# EAGLE design rectifiing (EAGLE 6.6.0)
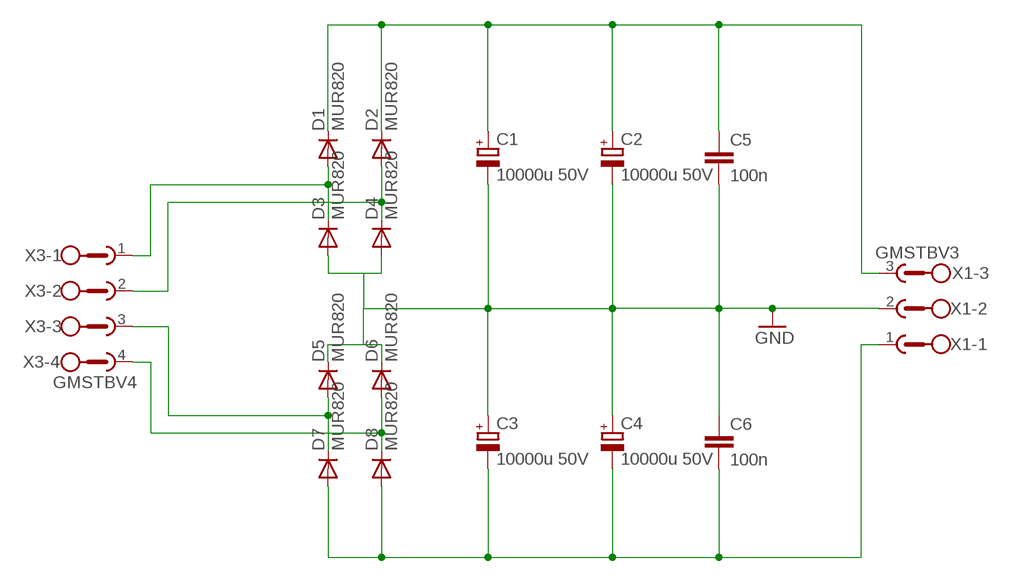
[diagram p0: schematic, sheet 1]

## Parts
C1  10000u 50V  CPOL-EUE10-30  [EB30D]
C2  10000u 50V  CPOL-EUE10-30  [EB30D]
C3  10000u 50V  CPOL-EUE10-30  [EB30D]
C4  10000u 50V  CPOL-EUE10-30  [EB30D]
C5  100n  C-EU075-032X103  [C075-032X103]
C6  100n  C-EU075-032X103  [C075-032X103]
D1  MUR820  MUR810  [TO220ACS]
D2  MUR820  MUR810  [TO220ACS]
D3  MUR820  MUR810  [TO220ACS]
D4  MUR820  MUR810  [TO220ACS]
D5  MUR820  MUR810  [TO220ACS]
D6  MUR820  MUR810  [TO220ACS]
D7  MUR820  MUR810  [TO220ACS]
D8  MUR820  MUR810  [TO220ACS]
X1  GMSTBV3  [GMSTBV3]
X3  GMSTBV4  [GMSTBV4]

## Nets
GND: C1.- C2.- C3.+ C4.+ C5.2 C6.1 D3.A D4.A D5.C D6.C X1.2
N$1: C1.+ C2.+ C5.1 D1.C D2.C X1.3
N$2: C3.- C4.- C6.2 D7.A D8.A X1.1
N$3: D1.A D3.C X3.1
N$4: D2.A D4.C X3.2
N$8: D6.A D8.C X3.4
N$13: D5.A D7.C X3.3

## Library data of the parts
C1-C4 = resistor:CPOL-EU: POLARIZED CAPACITOR, European symbol
C5 C6 = resistor:C-EU: CAPACITOR, European symbol
D1-D8 = diode:MUR810: DIODE
X1 = con-phoenix-762:GMSTBV3: PHOENIX; MPN: GMSTBVA2,5/3-G-7,62; OC_FARNELL: 1793080; OC_NEWARK: 69R9521
X3 = con-phoenix-762:GMSTBV4: PHOENIX; MPN: GMSTBVA2,5/4-G-7,62; OC_FARNELL: 1793082; OC_NEWARK: 69R9522

## Board
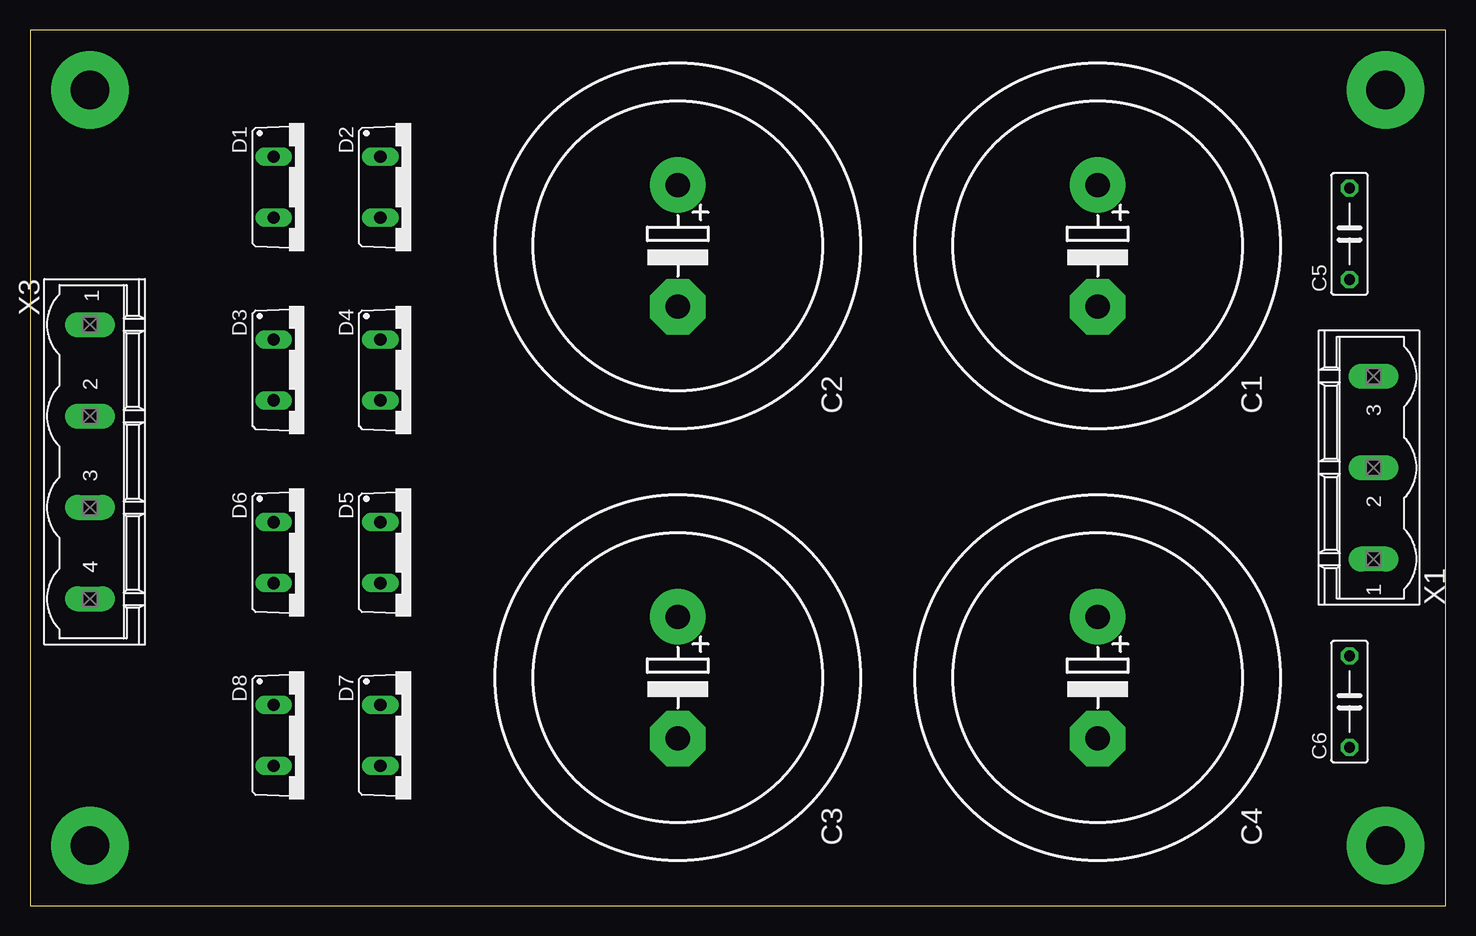
[diagram p1: board, top side]
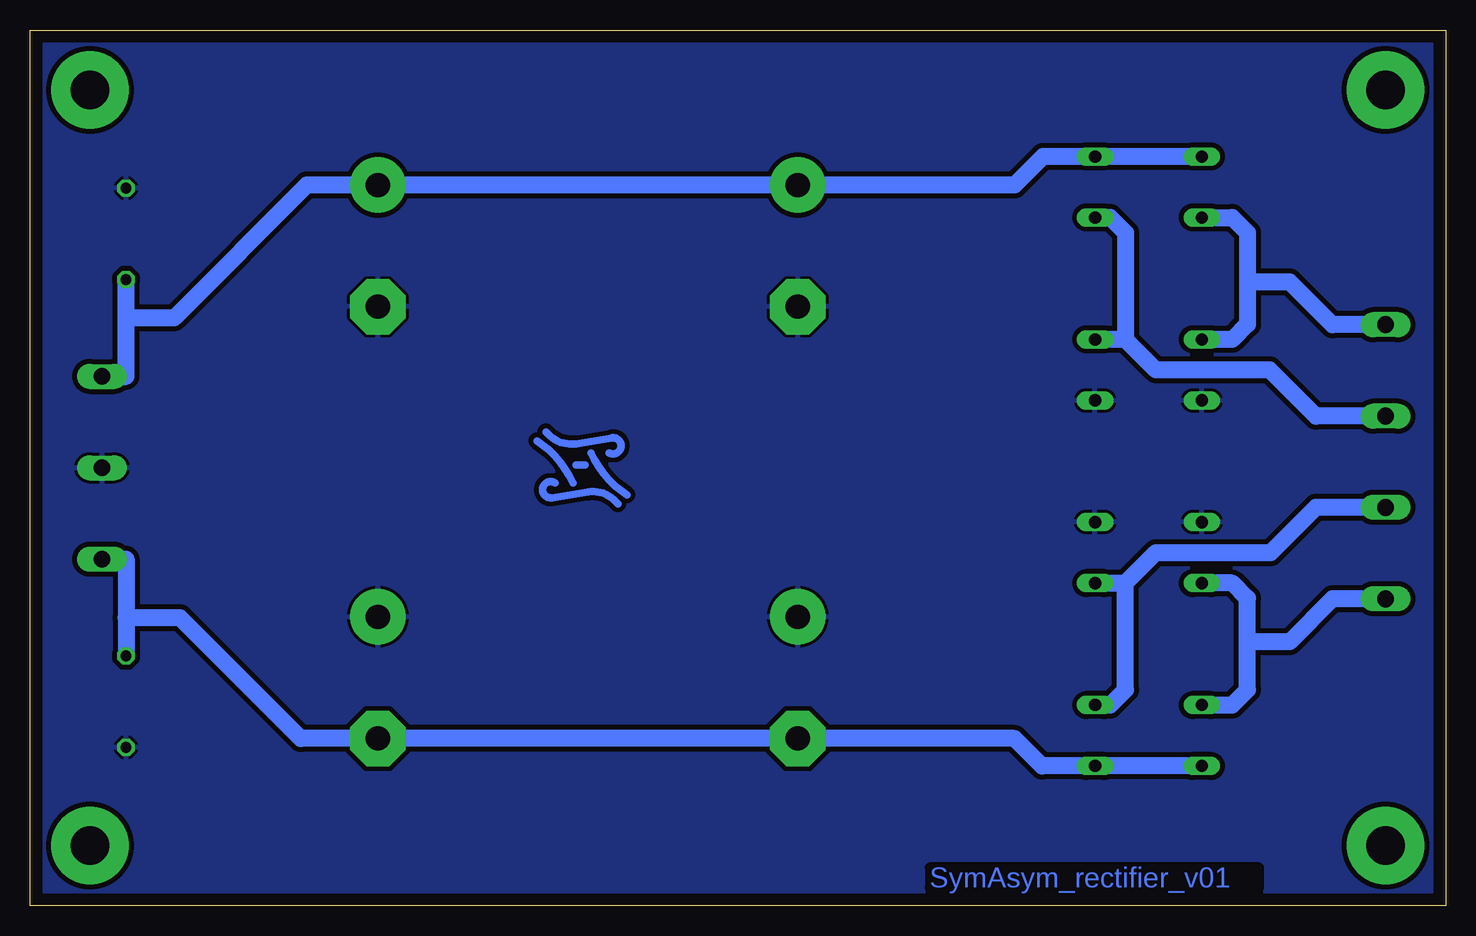
[diagram p2: board, bottom side, seen from below]

Size 118 x 73 mm. Coordinates in mm from the lower left corner, seen from the top.
Outline: 0,0 118,0 118,73 0,73 0,0
Copper layers (1*16): Top 0.035mm / dielectric 1.5mm / Bottom 0.035mm
Design rules "default": minimum track width 10mil, minimum drill 24mil, track to track 8mil, track to pad 8mil, pad to pad 8mil, via to via 8mil, smd to smd 8mil, copper to edge 40mil, drill to drill 8mil, minimum pad ring 10mil, minimum via ring 8mil, stop-mask expansion 4mil, vias tented up to drill 0mil, thermal gap 10mil

### Footprints (pad centres in the part's own frame; a part is rotated, then mirrored left to right if it is on the bottom)
EB30D = drill 2.007 pad 4.597: + -5.08,0 | drill 2.007 pad 4.597 octagon: - 5.08,0
C075-032X103 = drill 0.914 octagon: 1 -3.81,0; 2 3.81,0
TO220ACS = drill 1.016 long: A 2.54,-2.54; C -2.54,-2.54
GMSTBV3 = drill 1.397 long: 1 -7.62,0; 2 0,0; 3 7.62,0
GMSTBV4 = drill 1.397 long: 1 -11.43,0; 2 -3.81,0; 3 3.81,0; 4 11.43,0

### Placement (x,y rotation side)
C1  89,55 270 top
C2  54,55 270 top
C3  54,19 270 top
C4  89,19 270 top
C5  110,56 90 top
C6  110,17 90 top
D1  22.86,59.9 270 top
D2  31.75,59.9 270 top
D3  22.86,44.66 270 top
D4  31.75,44.66 270 top
D5  31.75,29.42 270 top
D6  22.86,29.42 270 top
D7  31.75,14.18 270 top
D8  22.86,14.18 270 top
X1  112,36.5 90 top
X3  5,37 270 top

### Tracks (layer width: path | path; a pad name or v marks a point on that pad's centre or on a via)
GND
  pour Bottom (isolate 0.406): 0,73.33 118.02,73.33 118.02,0 0,0
N$1
  Bottom 1.422: D1.C D2.C 33.56,62.44 35.92,60.08 C2.+ C1.+ 94.92,60.08 106,49 110,49 | X1.3 110,44.12 110,49 | 110,49 C5.1
N$2
  Bottom 1.422: D8.A D7.A 33.64,11.64 35.92,13.92 C3.- C4.- 95.42,13.92 105.5,24 110,24 | X1.1 110,28.88 110,24 | 110,24 C6.2
N$3
  Bottom 1.422: D1.A 17.78,57.36 16.51,56.09 16.51,52 | 16.51,52 16.51,48.47 17.78,47.2 D3.C | X3.1 9.43,48.43 13,52 16.51,52
N$4
  Bottom 1.422: 26.67,47.2 24.13,44.66 18,44.66 17.47,44.66 14.66,44.66 10.81,40.81 X3.2 | 26.67,47.2 D4.C | 26.67,47.2 26.67,56.09 27.94,57.36 D2.A
N$6  (via drill 3.2 pad 6.45)
  other vias: 5,68
N$7  (via drill 3.2 pad 6.45)
  other vias: 113,68
N$8
  Bottom 1.422: D8.C 17.78,16.72 16.51,17.99 16.51,22 | 16.51,22 16.51,25.61 17.78,26.88 D6.A | X3.4 9.43,25.57 13,22 16.51,22
N$9  (via drill 3.2 pad 6.45)
  other vias: 5,5
N$10  (via drill 3.2 pad 6.45)
  other vias: 113,5
N$13
  Bottom 1.422: D5.A 26.67,26.88 | 26.67,26.88 24.13,29.42 14.58,29.42 10.81,33.19 X3.3 | 26.67,26.88 26.67,17.99 27.94,16.72 D7.C
N$17
  Bottom 0.61: 75,39.5 arc-60 72.5,38.5 69.5,39 arc219 69.75,37.75
N$18
  Bottom 0.61: 69,33.5 arc-60 71.5,34.5 74.5,34 arc219 74.25,35.25
N$19
  Bottom 0.61: 68.25,34.25 69.25,35 arc23 71.25,37.75
N$20
  Bottom 0.61: 75.75,38.75 74.75,38 arc23 72.75,35.25
N$21
  Bottom 0.61: 71.75,36.75 72.5,36.75

### Text on the board
Bottom: SymAsym_rectifier_v01